# EAGLE design Fitbit REV 0 (EAGLE 7.7.0)
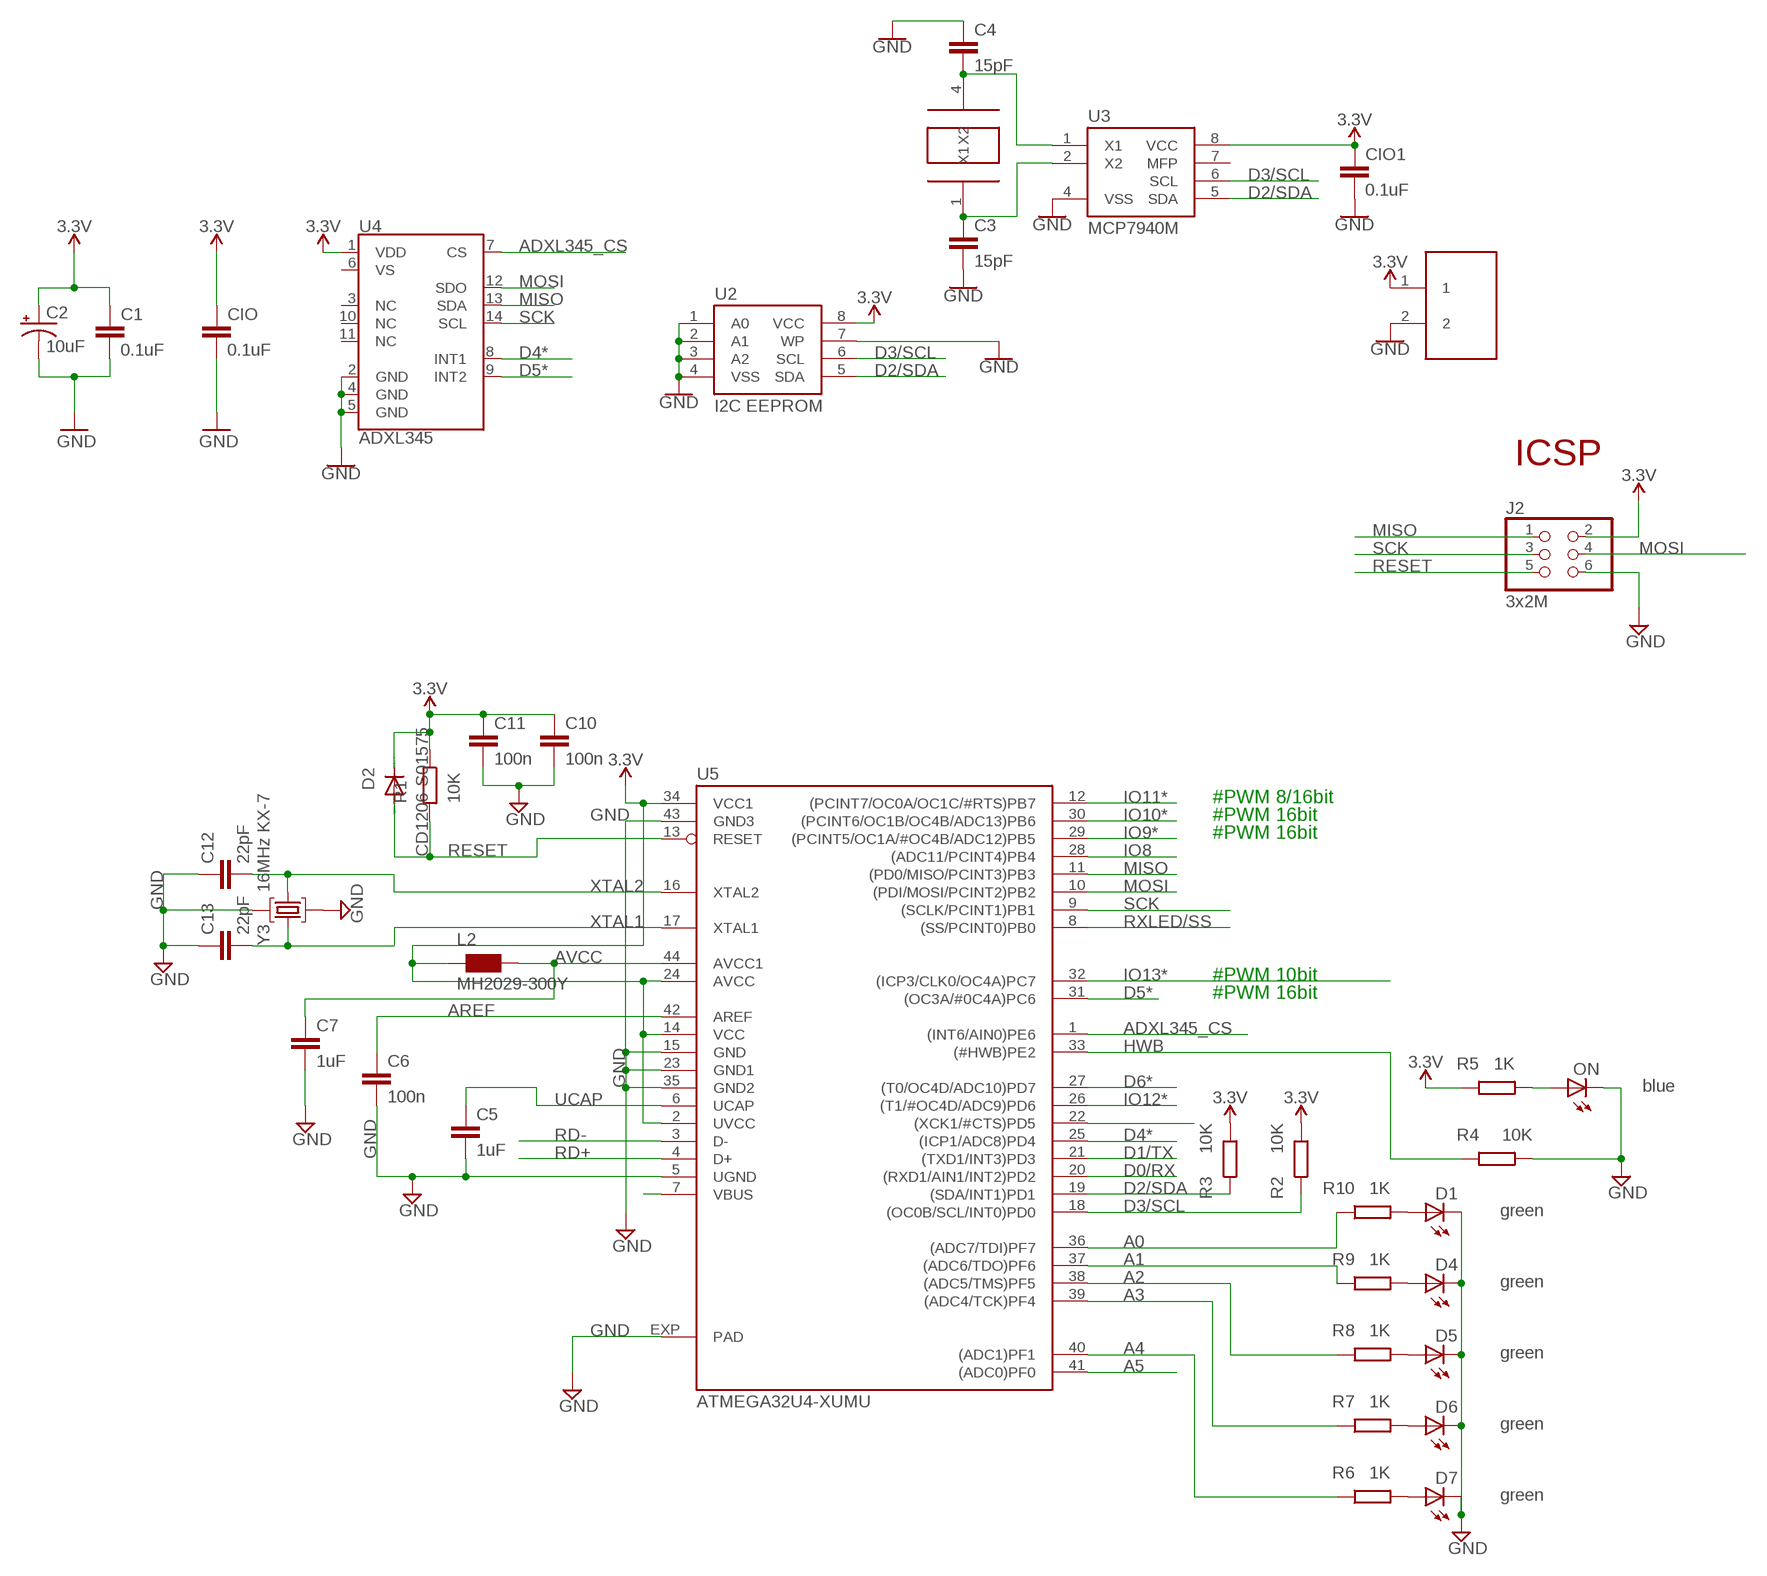
[diagram p0: schematic, sheet 1]

## Parts
C1  0.1uF  CAP0603-CAP  [0603-CAP]
C2  10uF  CAP_POL1206  [EIA3216]
C3  15pF  C-EUC0402  [C0402]
C4  15pF  C-EUC0402  [C0402]
C5  1uF  C-EUC0402  [C0402]
C6  100n  C-EUC0402  [C0402]
C7  1uF  C-EUC0402  [C0402]
C10  100n  C-EUC0402  [C0402]
C11  100n  C-EUC0402  [C0402]
C12  22pF  C-EUC0402  [C0402]
C13  22pF  C-EUC0402  [C0402]
CIO  0.1uF  CAP0603-CAP  [0603-CAP]
CIO1  0.1uF  CAP0603-CAP  [0603-CAP]
D1  green  LEDCHIPLED_0805  [CHIPLED_0805]
D2  CD1206-S01575  DIODE-MINIMELF  [MINIMELF]
D4  green  LEDCHIPLED_0805  [CHIPLED_0805]
D5  green  LEDCHIPLED_0805  [CHIPLED_0805]
D6  green  LEDCHIPLED_0805  [CHIPLED_0805]
D7  green  LEDCHIPLED_0805  [CHIPLED_0805]
J1  S2B-PH-SM4-TB(LF)(SN)  [S2B-PH-SM4-TB(LF)(SN)]
J2  3x2M  PINHD-2X3  [2X03]
L2  MH2029-300Y  WE-CBF_0805  [0805]
ON  blue  LEDCHIPLED_0805  [CHIPLED_0805]
R1  10K  R-EU_R0402  [R0402]
R2  10K  R-EU_R0402  [R0402]
R3  10K  R-EU_R0402  [R0402]
R4  10K  R-EU_R0402  [R0402]
R5  1K  R-EU_R0402  [R0402]
R6  1K  R-EU_R0402  [R0402]
R7  1K  R-EU_R0402  [R0402]
R8  1K  R-EU_R0402  [R0402]
R9  1K  R-EU_R0402  [R0402]
R10  1K  R-EU_R0402  [R0402]
U2  I2C EEPROM  EEPROM-I2CEIAJ  [SO08-EIAJ]
U3  MCP7940M  [MSOP8]
U4  ADXL345  [LGA-14]
U5  ATMEGA32U4-XUMU  [QFN44ML7X7]
Y1  MC-146_32.7680KA  [MC-146_32.7680KA]
Y3  16MHz KX-7  CRYSTAL-3.2-2.5  [CRYSTAL-3.2-2.5]

## Nets
3.3V: C1.1 C2.A(+) C10.1 C11.1 CIO1.1 CIO.1 D2.C J1.1 J2.2 L2.1 R1.1 R2.2 R3.2 R5.1 U2.8(VCC) U3.8(VCC) U4.1(VDD) U5.2(UVCC) U5.14(VCC) U5.24(AVCC) U5.34(VCC1)
A0: R10.1 U5.36((ADC7/TDI)PF7)
A1: R9.1 U5.37((ADC6/TDO)PF6)
A2: R8.1 U5.38((ADC5/TMS)PF5)
A3: R7.1 U5.39((ADC4/TCK)PF4)
A4: R6.1 U5.40((ADC1)PF1)
A5: U5.41((ADC0)PF0)
ADXL345_CS: U4.7(CS) U5.1((INT6/AIN0)PE6)
AREF: C6.1 U5.42(AREF)
AVCC: C7.1 L2.2 U5.44(AVCC1)
D0/RX: U5.20((RXD1/AIN1/INT2)PD2)
D1/TX: U5.21((TXD1/INT3)PD3)
D2/SDA: R3.1 U2.5(SDA) U3.5(SDA) U5.19((SDA/INT1)PD1)
D3/SCL: R2.1 U2.6(SCL) U3.6(SCL) U5.18((OC0B/SCL/INT0)PD0)
D4*: U5.25((ICP1/ADC8)PD4)
D5*: U5.31((OC3A/#0C4A)PC6)
D6*: U5.27((T0/OC4D/ADC10)PD7)
GND: C1.2 C2.C(-) C3.2 C4.1 C5.2 C6.2 C7.2 C10.2 C11.2 C12.1 C13.1 CIO1.2 CIO.2 D1.C D4.C D5.C D6.C D7.C J1.2 J2.6 ON.C R4.2 U2.1(A0) U2.2(A1) U2.3(A2) U2.4(VSS) U2.7(WP) U3.4(VSS) U4.2(GND) U4.4(GND) U4.5(GND) U5.5(UGND) U5.15(GND) U5.23(GND1) U5.35(GND2) U5.43(GND3) U5.EXP(PAD) Y3.2(GND) Y3.4(GND)
HWB: R4.1 U5.33((#HWB)PE2)
IO8: U5.28((ADC11/PCINT4)PB4)
IO9*: U5.29((PCINT5/OC1A/#OC4B/ADC12)PB5)
IO10*: U5.30((PCINT6/OC1B/OC4B/ADC13)PB6)
IO11*: U5.12((PCINT7/OC0A/OC1C/#RTS)PB7)
IO12*: U5.26((T1/#OC4D/ADC9)PD6)
IO13*: U5.32((ICP3/CLK0/OC4A)PC7)
MISO: J2.1 U4.13(SDA) U5.11((PD0/MISO/PCINT3)PB3)
MOSI: J2.4 U4.12(SDO) U5.10((PDI/MOSI/PCINT2)PB2)
N$1: U5.7(VBUS)
N$2: D7.A R6.2
N$3: ON.A R5.2
N$4: D6.A R7.2
N$5: D5.A R8.2
N$6: D4.A R9.2
N$7: D1.A R10.2
N$8: C3.1 U3.2(X2) Y1.1(X1)
N$9: C4.2 U3.1(X1) Y1.4(X2)
RD+: U5.4(D+)
RD-: U5.3(D-)
RESET: D2.A J2.5 R1.2 U5.13(RESET)
RXLED/SS: U5.8((SS/PCINT0)PB0)
SCK: J2.3 U4.14(SCL) U5.9((SCLK/PCINT1)PB1)
TXLED: U5.22((XCK1/#CTS)PD5)
UCAP: C5.1 U5.6(UCAP)
XTAL1: C13.2 U5.17(XTAL1) Y3.3(C2)
XTAL2: C12.2 U5.16(XTAL2) Y3.1(C1)
Unconnected: U3.7(MFP) U4.3(NC) U4.6(VS) U4.8(INT1) U4.9(INT2) U4.10(NC) U4.11(NC)

## Notes on the sheet
- ICSP
- #PWM 8/16bit
- #PWM 16bit
- #PWM 16bit
- #PWM 10bit
- #PWM 16bit

## Library data of the parts
C1 CIO CIO1 = SparkFun:CAP: Capacitor Standard 0603 ceramic capacitor, and 0.1" leaded capacitor.
C2 = SparkFun:CAP_POL: Capacitor Polarized These are standard SMD and PTH capacitors. Normally 10uF, 47uF, and 100uF in electrolytic and tantalum varieties. Always verify the external diameter of the through hole cap, it varies with capacity, voltage, and manufacturer. The EIA devices should be standard.
C3-C7 C10-C13 = SmartPrj:C-EU: CAPACITOR, European symbol
D1 D4-D7 ON = led:LED: LED OSRAM: - CHIPLED LG R971, LG N971, LY N971, LG Q971, LY Q971, LO R971, LY R971 LH N974, LH R974 LS Q976, LO Q976, LY Q976 LO Q996 - Hyper CHIPLED LW Q18S LB Q993, LB Q99A, LB R99A - SideLED LS A670, LO A670, LY A670, LG A670, LP A670 LB A673, LV A673, LT A673, LW A673 LH A674 LY A675 LS A676, LA A676, LO A676, LY A676, LW A676 LS A679, LY A679, LG A679 - Hyper Micro SIDELED® LS Y876, LA Y876, LO Y876, LY Y876 LT Y87S - SmartLED LW L88C, LW L88S LB L89C, LB L89S, LG L890 LS L89K, LO L89K, LY L89K LS L896, LA L896, LO L896, LY L896 - TOPLED LS T670, LO T670, LY T670, LG T670, LP T670 LSG T670, LSP T670, LSY T670, LOP T670, LYG T670 LG T671, LOG T671, LSG T671 LB T673, LV T673, LT T673, LW T673 LH T674 LS T676, LA T676, LO T676, LY T676, LB T676, LH T676, LSB T676, LW T676 LB T67C, LV T67C, LT T67C, LS T67K, LO T67K, LY T67K, LW E67C LS E67B, LA E67B, LO E67B, LY E67B, LB E67C, LV E67C, LT E67C LW T67C LS T679, LY T679, LG T679 LS T770, LO T770, LY T770, LG T770, LP T770 LB T773, LV T773, LT T773, LW T773 LH T774 LS E675, LA E675, LY E675, LS T675 LS T776, LA T776, LO T776, LY T776, LB T776 LHGB T686 LT T68C, LB T68C - Hyper Mini TOPLED® LB M676 - Mini TOPLED Santana® LG M470 LS M47K, LO M47K, LY M47K Source: http://www.osram.convergy.de LUXEON: - LUMILED® LXK2-PW12-R00, LXK2-PW12-S00, LXK2-PW14-U00, LXK2-PW14-V00 LXK2-PM12-R00, LXK2-PM12-S00, LXK2-PM14-U00 LXK2-PE12-Q00, LXK2-PE12-R00, LXK2-PE12-S00, LXK2-PE14-T00, LXK2-PE14-U00 LXK2-PB12-K00, LXK2-PB12-L00, LXK2-PB12-M00, LXK2-PB14-N00, LXK2-PB14-P00, LXK2-PB14-Q00 LXK2-PR12-L00, LXK2-PR12-M00, LXK2-PR14-Q00, LXK2-PR14-R00 LXK2-PD12-Q00, LXK2-PD12-R00, LXK2-PD12-S00 LXK2-PH12-R00, LXK2-PH12-S00 LXK2-PL12-P00, LXK2-PL12-Q00, LXK2-PL12-R00 Source: www.luxeon.com KINGBRIGHT: KA-3528ASYC Source: www.kingbright.com
D2 = diode:DIODE-: DIODE
J1 = MyParts:S2B-PH-SM4-TB(LF)(SN)
J2 = SmartPrj:PINHD-2X3: PIN HEADER
L2 = wuerth-elektronik:WE-CBF: SMD EMI Suppression Ferrite Beads - excellent anti-EMI properties - low DCR - impedances till 3000 ohms - rated current up to 6 A
R1-R10 = SmartPrj:R-EU_: RESISTOR, European symbol
U2 = SparkFun-IC-Memory:EEPROM-I2C: I2C EEPROMs, 24LC256 and others 24LC256 Series 256 kb I2C 2 Wire (32 k x 8 Bit) 2.5 V Serial EEPROM SMD - SOIC-8 Datasheet SparkFun Products SparkFun UDB5 - PIC UAV Development Board <https://www.sparkfun.com/products/11703> (GPS-11703); PROD_ID: NA-XXXXX
U3 = MyParts:MCP7940M: RTC MCP7940M Low Cost I2C
U4 = SparkFun-Sensors:ADXL345: Analog Devices ADXL345 3-Axis SPI/I2C 2/4/8/16g Accelerometer The ADXL345 is a small, thin, low power, 3-axis accelerometer with high resolution (13-bit) measurement at up to ±16g. Digital output data is formatted as 16-bit twos complement and is accessible through either a SPI (3- or 4-wire) or I2C digital interface. Datasheet <https://www.sparkfun.com/datasheets/Sensors/Accelerometer/ADXL345.pdf> SparkFun Products SparkFun Triple Axis Accelerometer Breakout - ADXL345 <https://www.sparkfun.com/products/9836> (SEN-09836) Triple Axis Accelerometer - ADXL345 <https://www.sparkfun.com/products/9045> (SEN-09045) SparkFun 6 Degrees of Freedom IMU Digital Combo Board - ITG3200/ADXL345 <https://www.sparkfun.com/products/10121> (SEN-10121); PROD_ID: IC-09097; SF_ID: SEN-09045
U5 = SmartPrj:ATMEGA32U4-XU
Y1 = MyParts:MC-146_32.7680KA
Y3 = SmartPrj:CRYSTAL-3.2-2.5

## Board
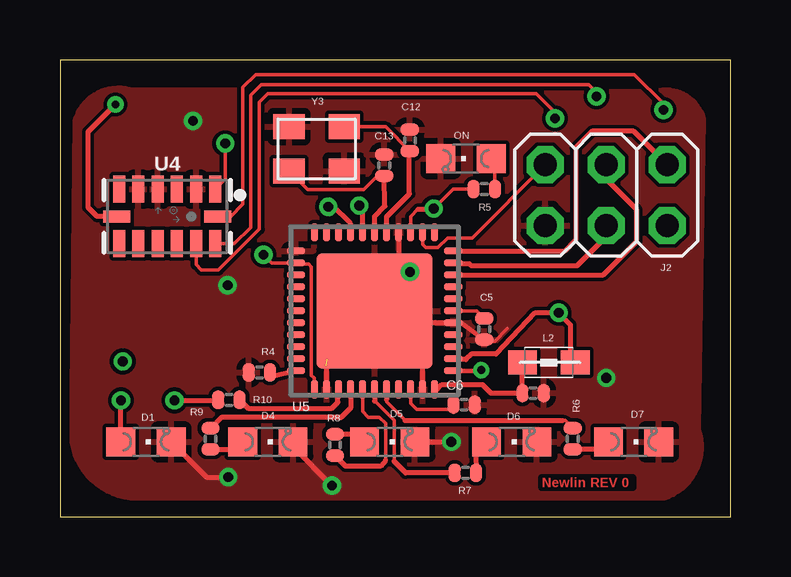
[diagram p1: board, top side]
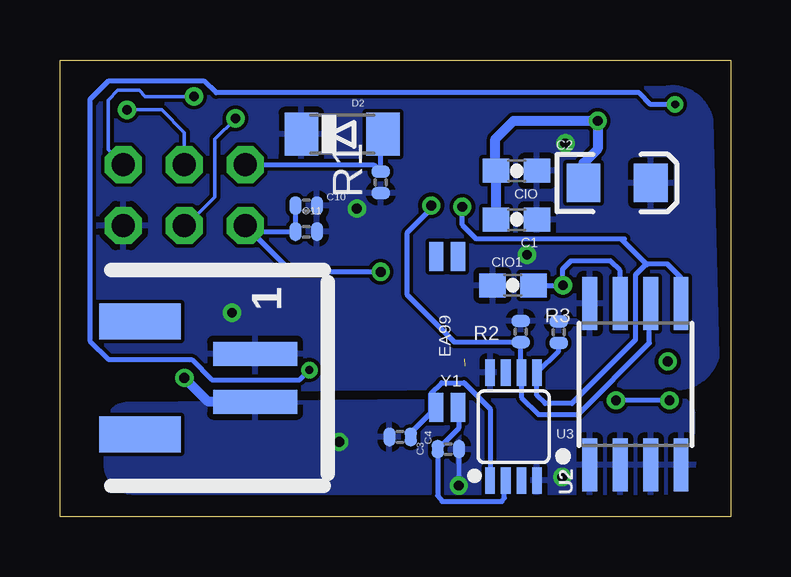
[diagram p2: board, bottom side, seen from below]

Size 27.94 x 19.05 mm. Coordinates in mm from the lower left corner, seen from the top.
Outline: 0,0 27.94,0 27.94,19.05 0,19.05 0,0
Copper layers (1*16): Top 0.0356mm / dielectric 1.5011mm / Bottom 0.0356mm
Design rules "LaenPCBOrder": minimum track width 6mil, minimum drill 13mil, track to track 6mil, track to pad 6mil, pad to pad 6mil, via to via 6mil, smd to smd 6mil, copper to edge 15mil, drill to drill 6mil, minimum pad ring 7mil, minimum via ring 7mil, stop-mask expansion 3mil, vias tented up to drill 0mil, thermal gap 10mil

### Footprints (pad centres in the part's own frame; a part is rotated, then mirrored left to right if it is on the bottom)
0603-CAP = smd 1.1 x 1: 1 -0.85,0; 2 0.85,0
EIA3216 = smd 1.4 x 1.6: A 1.4,0; C -1.4,0
C0402 = smd 0.508 x 0.762: 1 -0.445,0; 2 0.445,0
CHIPLED_0805 = smd 1.2 x 1.2: A 0,-1.05; C 0,1.05
MINIMELF = smd 1.4 x 1.8: A 1.7,0; C -1.7,0
S2B-PH-SM4-TB(LF)(SN) = smd 1 x 3.5: 1 1,-6.5; 2 -1,-6.5 | smd 1.5 x 3.4: MOUNT 2.35,-1.7; MOUNT_2 -2.35,-1.7
2X03 = drill 0.95 pad 1.55 octagon: 1 -2.54,-1.27; 2 -2.54,1.27; 3 0,-1.27; 4 0,1.27; 5 2.54,-1.27; 6 2.54,1.27
0805 = smd 1.2 x 1: 1 -1.1,0; 2 1.1,0
R0402 = smd 0.508 x 0.762: 1 -0.445,0; 2 0.445,0
SO08-EIAJ = smd 0.61 x 2.21: 1 -1.905,-3.378; 2 -0.635,-3.378; 3 0.635,-3.378; 4 1.905,-3.378; 5 1.905,3.353; 6 0.635,3.353; 7 -0.635,3.353; 8 -1.905,3.353
MSOP8 = smd 0.4 x 1.1: 1 -0.975,-2.25; 2 -0.325,-2.25; 3 0.325,-2.25; 4 0.975,-2.25; 5 0.975,2.25; 6 0.325,2.25; 7 -0.325,2.25; 8 -0.975,2.25
LGA-14 = smd 0.5 x 1.124: 1 2,1.138; 2 1.2,1.138; 3 0.4,1.138; 4 -0.4,1.138; 5 -1.2,1.138; 6 -2,1.138; 8 -2,-1.13; 9 -1.2,-1.138; 10 -0.4,-1.138; 11 0.4,-1.138; 12 1.2,-1.138; 13 2,-1.138 | smd 1.124 x 0.5: 7 -2.1,0; 14 2.1,0
QFN44ML7X7 = smd 0.75 x 0.275: 1 -3.275,2.5; 2 -3.275,2; 3 -3.275,1.5; 4 -3.275,1; 5 -3.275,0.5; 6 -3.275,0; 7 -3.275,-0.5; 8 -3.275,-1; 9 -3.275,-1.5; 10 -3.275,-2; 11 -3.275,-2.5; 23 3.275,-2.5; 24 3.275,-2; 25 3.275,-1.5; 26 3.275,-1; 27 3.275,-0.5; 28 3.275,0; 29 3.275,0.5; 30 3.275,1; 31 3.275,1.5; 32 3.275,2; 33 3.275,2.5 | smd 0.275 x 0.75: 12 -2.5,-3.275; 13 -2,-3.275; 14 -1.5,-3.275; 15 -1,-3.275; 16 -0.5,-3.275; 17 0,-3.275; 18 0.5,-3.275; 19 1,-3.275; 20 1.5,-3.275; 21 2,-3.275; 22 2.5,-3.275; 34 2.5,3.275; 35 2,3.275; 36 1.5,3.275; 37 1,3.275; 38 0.5,3.275; 39 0,3.275; 40 -0.5,3.275; 41 -1,3.275; 42 -1.5,3.275; 43 -2,3.275; 44 -2.5,3.275 | smd 4.826 x 4.826: EXP 0,0
MC-146_32.7680KA = smd 1.2 x 0.6: 1 -0.6,-0.6; 2 5.7,-0.6; 3 5.7,0.3; 4 -0.6,0.3
CRYSTAL-3.2-2.5 = smd 1.3 x 1.05: 1 -1.15,-0.925; 2 1.15,-0.925; 3 1.15,0.925; 4 -1.15,0.925

### Placement (x,y rotation side)
C1  8.92,12.4 180 bottom
C2  4.72,13.92 0 bottom
C3  11.76,2.82 0 bottom
C4  13.77,3.33 0 bottom
C5  17.68,7.82 270 top
C6  16.84,4.67 0 top
C7  19.71,5.16 0 top
C10  17.68,12.98 180 bottom
C11  17.68,11.89 180 bottom
C12  14.58,15.7 270 top
C13  13.51,14.66 270 top
CIO  8.92,14.43 180 bottom
CIO1  9.07,9.65 0 bottom
D1  3.58,3.12 270 top
D2  16.18,15.95 0 bottom
D4  8.66,3.12 270 top
D5  13.74,3.12 270 top
D6  18.82,3.12 270 top
D7  23.9,3.12 270 top
J1  26.31,5.79 90 bottom
J2  22.76,13.41 180 top
L2  20.37,6.43 180 top
ON  16.92,14.94 90 top
R1  14.58,13.94 90 bottom
R2  8.74,7.72 90 bottom
R3  7.16,7.7 90 bottom
R4  8.31,6.02 180 top
R5  17.68,13.67 0 top
R6  21.36,3.25 270 top
R7  16.89,1.83 0 top
R8  11.46,3 90 top
R9  6.27,3.25 270 top
R10  7.04,4.88 180 top
U2  3.96,5.54 0 bottom
U3  9.04,3.76 0 bottom
U4  4.47,12.52 0 top
U5  13.11,8.59 180 top
Y1  11.96,5.16 90 bottom
Y3  10.69,15.34 180 top

### Tracks (layer width: path | path; a pad name or v marks a point on that pad's centre or on a via)
3.3V  (via drill 0.41)
  Top 0.152: U5.14 14.61,12.52 14.91,12.83 | R5.1 16.38,13.66 v15.57,12.85 | U5.34 10.59,5.33 10.59,5.79 10.46,5.89 10.46,10.41 10.36,10.54 9.88,10.54 U5.24 8.82,10.59 v8.48,10.92 | U4.1 6.88,14.07 v6.88,15.57 | 21.27,6.6 L2.1
  Top 0.203: 14.91,12.83 15.54,12.83 v15.57,12.85 | 21.27,6.6 21.27,8.02 v20.78,8.51 19.81,8.51 18.17,6.79 17.15,6.79 16.92,6.55 16.41,6.55 U5.2
  pour Bottom: 0.81,16.56 arc-90 2.79,17.86 25.37,17.96 arc-90 26.49,14.68 26.57,6.78 arc-90 24.28,5.31 2.69,5.44 arc-90 0.56,6.68
A0
  Top 0.203: U5.36 11.58,5.29 11.58,4.78 11.33,4.52 7.84,4.52 R10.1
A1
  Top 0.203: U5.37 12.11,4.54 11.71,4.14 6.72,4.14 R9.1
A2
  Top 0.152: U5.38 12.61,4.39 12.85,4.14 13.31,4.14 13.56,3.89 13.56,2.36
  Top 0.203: 13.56,2.36 13.36,2.11 11.9,2.11 R8.1
A3
  Top 0.152: 13.92,2.31 13.92,4.01 13.11,4.83
  Top 0.203: U5.39 13.11,4.83 | R7.1 14.4,1.83 13.92,2.31
A4
  Top 0.152: 13.61,4.88 13.61,4.78 14.38,4.01 | 20.94,4.01 21.04,4.01 R6.1
  Top 0.203: U5.40 13.61,4.88 | 14.38,4.01 20.94,4.01
ADXL345_CS  (via drill 0.33)
  Top 0.203: U5.1 17.49,6.11 v17.55,6.12 | U4.7 1.55,12.52 1.17,12.9 1.17,16.05 v2.31,17.2
  Bottom 0.203: v2.31,17.2 3.33,17.2 3.81,17.68 21.44,17.68 21.92,18.16 25.93,18.16 26.7,17.4 26.7,7.34 25.91,6.55 22.45,6.55 21.61,5.71 17.96,5.71 v17.55,6.12
AREF
  Top 0.152: 14.61,4.95 U5.42 | 14.61,4.95 | 14.61,4.95 14.61,4.72 14.86,4.47 16.19,4.47 C6.1
AVCC
  Top 0.152: 15.61,5.17 U5.44 15.66,5.26 | 19.16,5.26 C7.1
  Top 0.203: L2.2 19.27,5.95 C7.1 17.96,5.16 17.6,5.51 15.91,5.51 15.66,5.26
D2/SDA  (via drill 0.41)
  Top 0.203: U5.19 12.11,12.23 11.35,12.98 11.3,12.93 v11.18,12.93
  Bottom 0.203: U2.5 2.06,9.96 2.64,10.54 3.5,10.54 | 3.5,10.54 3.96,10.08 3.96,7.38 6.62,4.72 7.72,4.72 8.07,5.07 U3.5 7.16,6.91 R3.1 | 3.48,10.52 3.5,10.54 | 4.42,11.58 4.55,11.58 | 11.18,12.95 v11.18,12.93 11.18,12.17 10.59,11.58 4.93,11.58 4.55,11.58 | 3.5,10.54 4.55,11.58
D3/SCL  (via drill 0.41)
  Top 0.152: 12.61,13 12.59,12.98 v12.47,12.98
  Top 0.203: U5.18 12.61,13
  Bottom 0.203: U2.6 3.38,8.84 3.38,7.24 6.35,4.27 8,4.27 8.72,4.98 U3.6 8.74,6.03 R2.1 11.49,7.28 13.46,9.25 13.46,11.86 12.47,12.85 v12.47,12.98
GND  (via drill 0.41)  (1 unrouted)
  Top 0.152: 17.65,7.32 18.11,7.32 18.64,7.85
  Top 0.203: U5.35 11.11,6.27 | C12.1 14.66,16.14 | D5.C v16.31,3.12 | U5.15 14.11,10.76 14.17,10.69 14.17,10.62 v14.58,10.21 | 15.1,8.09 U5.5 16.72,8.09 C5.2 | 15.1,8.09 15.09,8.08 | U5.43 15.11,6.37 | 15.11,6.37 15.11,6.38 | D4.C 9.71,2.91 v11.33,1.29 | 15.11,6.37 15.11,9.68 v14.58,10.21 | 15.1,8.09 15.1,9.7 v14.58,10.21 | v14.58,10.21 14.58,10.06 | 14.58,10.06 U5.EXP 11.11,6.58 | 14.58,10.06 14.33,10.06 14.12,9.86 | D1.C 6.11,1.65 v7.01,1.65
  Top 0.305: 14.11,9.87 14.12,9.86 | 11.11,6.27 11.07,6.3
  Bottom 0.203: C10.2 C11.2 19.96,11.89 J2.6 18.29,10.21 v14.58,10.21 | CIO1.2 v6.99,9.65 7.01,9.68 7.01,10.31 6.66,10.67 5,10.67 4.6,10.26 U2.7 | C3.2 v11.33,1.29
  Bottom 0.406: J1.2 21.76,4.79 v22.76,5.79 | C1.2 CIO.2 9.8,14.09 9.8,15.75 9.04,16.51 v5.54,16.51 5.54,15.34 6.12,14.75 C2.C
  pour Top: 0.64,16.51 arc-90 2.9,17.83 24.82,17.75 arc-90 26.8,16.61 26.59,3.63 arc-90 25.17,0.76 3.45,0.76 arc-90 0.48,3.35
  pour Bottom: 1.57,3.86 1.52,2.39 arc90 2.92,0.99 24.79,0.99 arc90 26.01,2.21 26.01,3.78 arc90 25.1,4.7 2.24,4.93 arc90 1.57,4.27
HWB
  Top 0.203: U5.33 8.81,5.83 R4.1
MISO  (via drill 0.41)
  Top 0.152: v22.35,17.53 22.35,17.68 22.02,18.01 8.38,18.01 7.95,17.58 7.95,12.06 7.27,11.38 U4.13
  Top 0.203: J2.1 23.9,16.08 22.17,16.08 21.49,15.39 21.49,11.53 21.04,11.09 U5.11
  Bottom 0.152: v22.35,17.53 24.38,17.53 24.64,17.78 25.53,17.78 25.93,17.37 25.93,15.32 J2.1
MOSI  (via drill 0.41)
  Top 0.152: U4.12 5.67,10.51 5.89,10.29 6.6,10.29 8.31,11.99 8.31,17.3 8.66,17.65 19.84,17.65 20.62,16.87 v20.62,16.61
  Top 0.203: J2.4 22.76,11.68 21.54,10.46 17.14,10.46 17.07,10.54 16.43,10.54 U5.10
  Bottom 0.152: v20.62,16.61 21.49,15.75 21.49,13.34 22.68,12.14 J2.4
N$2
  Top 0.203: D7.A 22.53,2.81 R6.2
N$3
  Top 0.152: R5.2 18.12,14.78 ON.A
N$4
  Top 0.203: 17.87,3.41 D6.A 17.33,2.68 R7.2
N$5
  Top 0.203: D5.A 12.37,3.44 R8.2
N$6
  Top 0.203: R9.2 7.29,2.81 D4.A
N$7  (via drill 0.41)
  Top 0.203: 2.5,3.15 D1.A v2.53,4.84 v2.54,4.85 | v4.78,4.85 6.57,4.85 R10.2
  Bottom 0.203: v2.54,4.85 v4.78,4.85
N$8
  Bottom 0.203: Y1.1 11.33,4.52 11.33,3.7 C3.1 12.21,0.88 12.01,0.64 9.53,0.64 9.42,0.79 9.42,1.45 U3.2
N$9
  Bottom 0.203: 10.03,1.52 U3.1 10.02,4.51 11.1,5.59 12.04,5.59 12.48,5.14 12.48,4.33 | C4.2 13.32,3.5 12.48,4.33 | 12.48,4.33 Y1.4
N$10  (via drill 0.41)
  other vias: 2.62,6.48
RESET
  Top 0.152: U5.13 15.11,11.36 15.24,11.23 15.75,11.23 16.15,11.63 17.17,11.63 J2.5
  Bottom 0.203: J2.5 14.87,14.68 R1.2 14.58,15.85 D2.A
SCK  (via drill 0.41)
  Top 0.152: U4.14 7.11,12.52 7.62,13.03 7.62,17.91 8.15,18.44 23.93,18.44 25.15,17.22 v25.15,16.97
  Top 0.203: J2.3 22.76,14.07 24.03,12.8 24.03,11.48 22.63,10.09 U5.9
  Bottom 0.152: J2.3 22.76,16.03 23.7,16.97 v25.15,16.97
UCAP
  Top 0.152: U5.6 17.36,8.59 C5.1
XTAL1
  Top 0.152: Y3.3 10.32,13.64 12.65,13.64 13.22,14.21
  Top 0.203: U5.17 13.11,12.52 13.54,12.95 C13.2 13.22,14.21
XTAL2
  Top 0.152: 14.58,15.29 C12.2 13.57,16.27 Y3.1
  Top 0.203: U5.16 13.61,12.51 14.55,13.46 14.55,15.23 C12.2

### Text on the board
Top: Newlin REV 0